# EAGLE design Bus_Control (EAGLE 9.6.2)
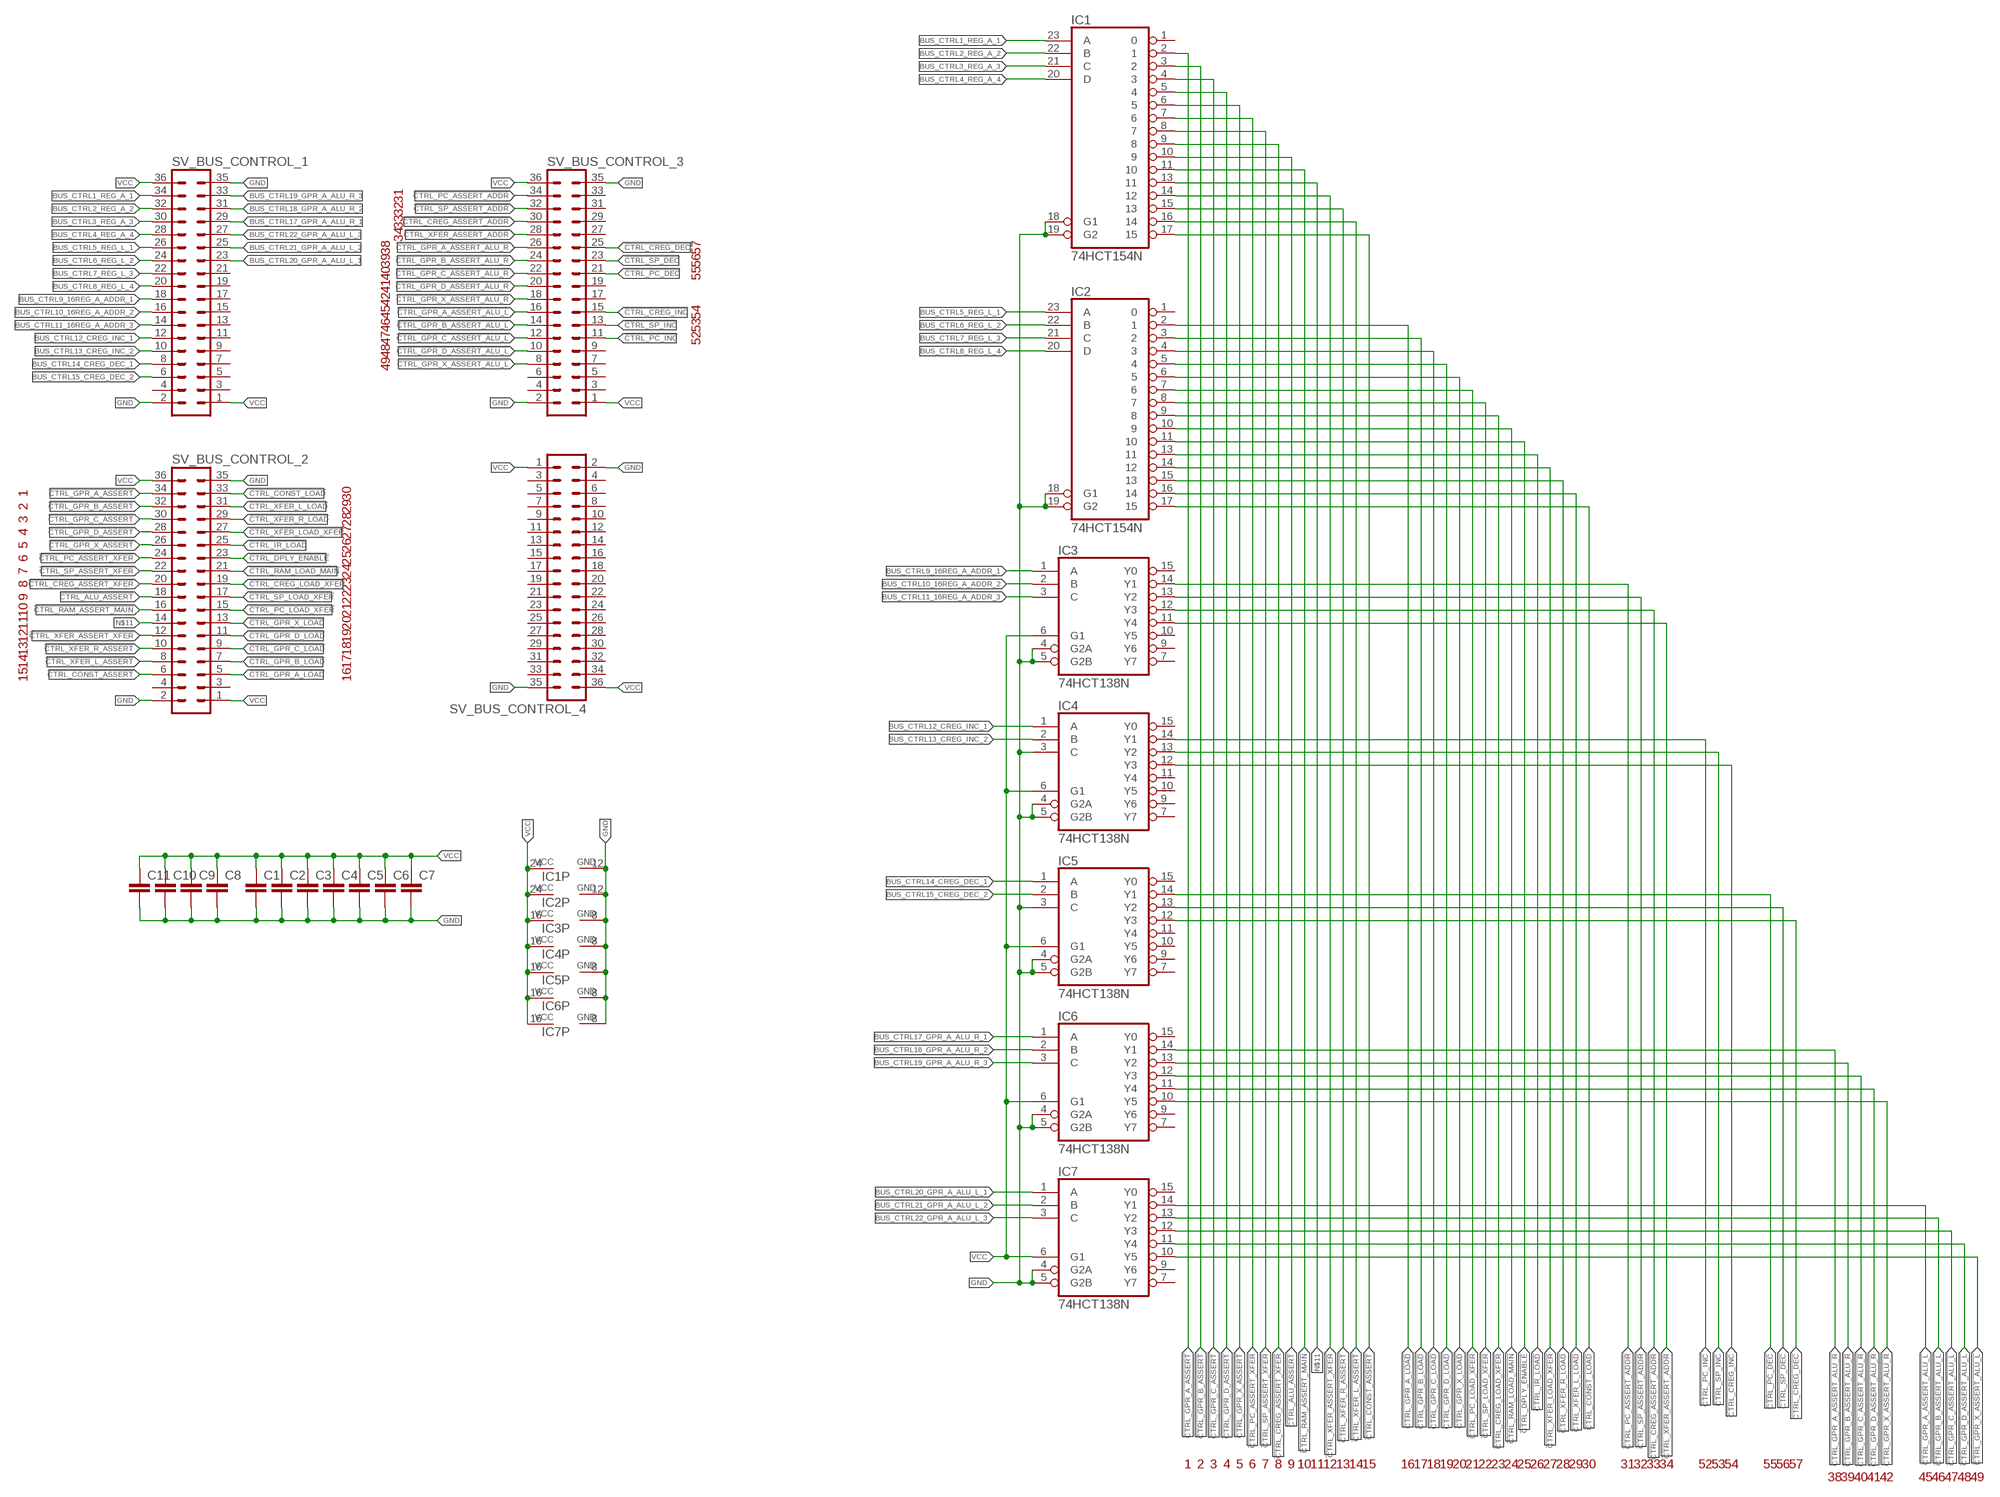
[diagram p0: schematic, sheet 1]

## Parts
C1  C-EUC0805  [C0805]
C2  C-EUC0805  [C0805]
C3  C-EUC0805  [C0805]
C4  C-EUC0805  [C0805]
C5  C-EUC0805  [C0805]
C6  C-EUC0805  [C0805]
C7  C-EUC0805  [C0805]
C8  C-EUC0805  [C0805]
C9  C-EUC0805  [C0805]
C10  C-EUC0805  [C0805]
C11  C-EUC0805  [C0805]
IC1  74HCT154N  74HC154N  [DIL24-6]
IC2  74HCT154N  74HC154N  [DIL24-6]
IC3  74HCT138N  [DIL16]
IC4  74HCT138N  [DIL16]
IC5  74HCT138N  [DIL16]
IC6  74HCT138N  [DIL16]
IC7  74HCT138N  [DIL16]
SV_BUS_CONTROL_1  MA18-2  [MA18-2]
SV_BUS_CONTROL_2  MA18-2  [MA18-2]
SV_BUS_CONTROL_3  MA18-2  [MA18-2]
SV_BUS_CONTROL_4  MA18-2  [MA18-2]

## Nets
!CTRL_ALU_ASSERT: IC1.10 SV_BUS_CONTROL_2.18
!CTRL_CONST_ASSERT: IC1.17 SV_BUS_CONTROL_2.6
!CTRL_CONST_LOAD: IC2.17 SV_BUS_CONTROL_2.33
!CTRL_CREG_ASSERT_ADDR: IC3.12(Y3) SV_BUS_CONTROL_3.30
!CTRL_CREG_ASSERT_XFER: IC1.9 SV_BUS_CONTROL_2.20
!CTRL_CREG_DEC: IC5.12(Y3) SV_BUS_CONTROL_3.25
!CTRL_CREG_INC: IC4.12(Y3) SV_BUS_CONTROL_3.15
!CTRL_CREG_LOAD_XFER: IC2.9 SV_BUS_CONTROL_2.19
!CTRL_DPLY_ENABLE: IC2.11 SV_BUS_CONTROL_2.23
!CTRL_GPR_A_ASSERT: IC1.2 SV_BUS_CONTROL_2.34
!CTRL_GPR_A_ASSERT_ALU_L: IC7.14(Y1) SV_BUS_CONTROL_3.16
!CTRL_GPR_A_ASSERT_ALU_R: IC6.14(Y1) SV_BUS_CONTROL_3.26
!CTRL_GPR_A_LOAD: IC2.2 SV_BUS_CONTROL_2.5
!CTRL_GPR_B_ASSERT: IC1.3 SV_BUS_CONTROL_2.32
!CTRL_GPR_B_ASSERT_ALU_L: IC7.13(Y2) SV_BUS_CONTROL_3.14
!CTRL_GPR_B_ASSERT_ALU_R: IC6.13(Y2) SV_BUS_CONTROL_3.24
!CTRL_GPR_B_LOAD: IC2.3 SV_BUS_CONTROL_2.7
!CTRL_GPR_C_ASSERT: IC1.4 SV_BUS_CONTROL_2.30
!CTRL_GPR_C_ASSERT_ALU_L: IC7.12(Y3) SV_BUS_CONTROL_3.12
!CTRL_GPR_C_ASSERT_ALU_R: IC6.12(Y3) SV_BUS_CONTROL_3.22
!CTRL_GPR_C_LOAD: IC2.4 SV_BUS_CONTROL_2.9
!CTRL_GPR_D_ASSERT: IC1.5 SV_BUS_CONTROL_2.28
!CTRL_GPR_D_ASSERT_ALU_L: IC7.11(Y4) SV_BUS_CONTROL_3.10
!CTRL_GPR_D_ASSERT_ALU_R: IC6.11(Y4) SV_BUS_CONTROL_3.20
!CTRL_GPR_D_LOAD: IC2.5 SV_BUS_CONTROL_2.11
!CTRL_GPR_X_ASSERT: IC1.6 SV_BUS_CONTROL_2.26
!CTRL_GPR_X_ASSERT_ALU_L: IC7.10(Y5) SV_BUS_CONTROL_3.8
!CTRL_GPR_X_ASSERT_ALU_R: IC6.10(Y5) SV_BUS_CONTROL_3.18
!CTRL_GPR_X_LOAD: IC2.6 SV_BUS_CONTROL_2.13
!CTRL_IR_LOAD: IC2.13 SV_BUS_CONTROL_2.25
!CTRL_PC_ASSERT_ADDR: IC3.14(Y1) SV_BUS_CONTROL_3.34
!CTRL_PC_ASSERT_XFER: IC1.7 SV_BUS_CONTROL_2.24
!CTRL_PC_DEC: IC5.14(Y1) SV_BUS_CONTROL_3.21
!CTRL_PC_INC: IC4.14(Y1) SV_BUS_CONTROL_3.11
!CTRL_PC_LOAD_XFER: IC2.7 SV_BUS_CONTROL_2.15
!CTRL_RAM_ASSERT_MAIN: IC1.11 SV_BUS_CONTROL_2.16
!CTRL_RAM_LOAD_MAIN: IC2.10 SV_BUS_CONTROL_2.21
!CTRL_SP_ASSERT_ADDR: IC3.13(Y2) SV_BUS_CONTROL_3.32
!CTRL_SP_ASSERT_XFER: IC1.8 SV_BUS_CONTROL_2.22
!CTRL_SP_DEC: IC5.13(Y2) SV_BUS_CONTROL_3.23
!CTRL_SP_INC: IC4.13(Y2) SV_BUS_CONTROL_3.13
!CTRL_SP_LOAD_XFER: IC2.8 SV_BUS_CONTROL_2.17
!CTRL_XFER_ASSERT_ADDR: IC3.11(Y4) SV_BUS_CONTROL_3.28
!CTRL_XFER_ASSERT_XFER: IC1.14 SV_BUS_CONTROL_2.12
!CTRL_XFER_L_ASSERT: IC1.16 SV_BUS_CONTROL_2.8
!CTRL_XFER_L_LOAD: IC2.16 SV_BUS_CONTROL_2.31
!CTRL_XFER_LOAD_XFER: IC2.14 SV_BUS_CONTROL_2.27
!CTRL_XFER_R_ASSERT: IC1.15 SV_BUS_CONTROL_2.10
!CTRL_XFER_R_LOAD: IC2.15 SV_BUS_CONTROL_2.29
BUS_CTRL1_REG_A_1: IC1.23(A) SV_BUS_CONTROL_1.34
BUS_CTRL2_REG_A_2: IC1.22(B) SV_BUS_CONTROL_1.32
BUS_CTRL3_REG_A_3: IC1.21(C) SV_BUS_CONTROL_1.30
BUS_CTRL4_REG_A_4: IC1.20(D) SV_BUS_CONTROL_1.28
BUS_CTRL5_REG_L_1: IC2.23(A) SV_BUS_CONTROL_1.26
BUS_CTRL6_REG_L_2: IC2.22(B) SV_BUS_CONTROL_1.24
BUS_CTRL7_REG_L_3: IC2.21(C) SV_BUS_CONTROL_1.22
BUS_CTRL8_REG_L_4: IC2.20(D) SV_BUS_CONTROL_1.20
BUS_CTRL9_16REG_A_ADDR_1: IC3.1(A) SV_BUS_CONTROL_1.18
BUS_CTRL10_16REG_A_ADDR_2: IC3.2(B) SV_BUS_CONTROL_1.16
BUS_CTRL11_16REG_A_ADDR_3: IC3.3(C) SV_BUS_CONTROL_1.14
BUS_CTRL12_CREG_INC_1: IC4.1(A) SV_BUS_CONTROL_1.12
BUS_CTRL13_CREG_INC_2: IC4.2(B) SV_BUS_CONTROL_1.10
BUS_CTRL14_CREG_DEC_1: IC5.1(A) SV_BUS_CONTROL_1.8
BUS_CTRL15_CREG_DEC_2: IC5.2(B) SV_BUS_CONTROL_1.6
BUS_CTRL17_GPR_A_ALU_R_1: IC6.1(A) SV_BUS_CONTROL_1.29
BUS_CTRL18_GPR_A_ALU_R_2: IC6.2(B) SV_BUS_CONTROL_1.31
BUS_CTRL19_GPR_A_ALU_R_3: IC6.3(C) SV_BUS_CONTROL_1.33
BUS_CTRL20_GPR_A_ALU_L_1: IC7.1(A) SV_BUS_CONTROL_1.23
BUS_CTRL21_GPR_A_ALU_L_2: IC7.2(B) SV_BUS_CONTROL_1.25
BUS_CTRL22_GPR_A_ALU_L_3: IC7.3(C) SV_BUS_CONTROL_1.27
GND: C1.2 C2.2 C3.2 C4.2 C5.2 C6.2 C7.2 C8.2 C9.2 C10.2 C11.2 IC1.12(GND) IC1.18(G1) IC1.19(G2) IC2.12(GND) IC2.18(G1) IC2.19(G2) IC3.4(G2A) IC3.5(G2B) IC3.8(GND) IC4.3(C) IC4.4(G2A) IC4.5(G2B) IC4.8(GND) IC5.3(C) IC5.4(G2A) IC5.5(G2B) IC5.8(GND) IC6.4(G2A) IC6.5(G2B) IC6.8(GND) IC7.4(G2A) IC7.5(G2B) IC7.8(GND) SV_BUS_CONTROL_1.2 SV_BUS_CONTROL_1.35 SV_BUS_CONTROL_2.2 SV_BUS_CONTROL_2.35 SV_BUS_CONTROL_3.2 SV_BUS_CONTROL_3.35 SV_BUS_CONTROL_4.2 SV_BUS_CONTROL_4.35
N$11: IC1.13 SV_BUS_CONTROL_2.14
VCC: C1.1 C2.1 C3.1 C4.1 C5.1 C6.1 C7.1 C8.1 C9.1 C10.1 C11.1 IC1.24(VCC) IC2.24(VCC) IC3.6(G1) IC3.16(VCC) IC4.6(G1) IC4.16(VCC) IC5.6(G1) IC5.16(VCC) IC6.6(G1) IC6.16(VCC) IC7.6(G1) IC7.16(VCC) SV_BUS_CONTROL_1.1 SV_BUS_CONTROL_1.36 SV_BUS_CONTROL_2.1 SV_BUS_CONTROL_2.36 SV_BUS_CONTROL_3.1 SV_BUS_CONTROL_3.36 SV_BUS_CONTROL_4.1 SV_BUS_CONTROL_4.36
Unconnected: IC1.1 IC2.1 IC3.7(Y7) IC3.9(Y6) IC3.10(Y5) IC3.15(Y0) IC4.7(Y7) IC4.9(Y6) IC4.10(Y5) IC4.11(Y4) IC4.15(Y0) IC5.7(Y7) IC5.9(Y6) IC5.10(Y5) IC5.11(Y4) IC5.15(Y0) IC6.7(Y7) IC6.9(Y6) IC6.15(Y0) IC7.7(Y7) IC7.9(Y6) IC7.15(Y0) SV_BUS_CONTROL_1.3 SV_BUS_CONTROL_1.4 SV_BUS_CONTROL_1.5 SV_BUS_CONTROL_1.7 SV_BUS_CONTROL_1.9 SV_BUS_CONTROL_1.11 SV_BUS_CONTROL_1.13 SV_BUS_CONTROL_1.15 SV_BUS_CONTROL_1.17 SV_BUS_CONTROL_1.19 SV_BUS_CONTROL_1.21 SV_BUS_CONTROL_2.3 SV_BUS_CONTROL_2.4 SV_BUS_CONTROL_3.3 SV_BUS_CONTROL_3.4 SV_BUS_CONTROL_3.5 SV_BUS_CONTROL_3.6 SV_BUS_CONTROL_3.7 SV_BUS_CONTROL_3.9 SV_BUS_CONTROL_3.17 SV_BUS_CONTROL_3.19 SV_BUS_CONTROL_3.27 SV_BUS_CONTROL_3.29 SV_BUS_CONTROL_3.31 SV_BUS_CONTROL_3.33 SV_BUS_CONTROL_4.3 SV_BUS_CONTROL_4.4 SV_BUS_CONTROL_4.5 SV_BUS_CONTROL_4.6 SV_BUS_CONTROL_4.7 SV_BUS_CONTROL_4.8 SV_BUS_CONTROL_4.9 SV_BUS_CONTROL_4.10 SV_BUS_CONTROL_4.11 SV_BUS_CONTROL_4.12 SV_BUS_CONTROL_4.13 SV_BUS_CONTROL_4.14 SV_BUS_CONTROL_4.15 SV_BUS_CONTROL_4.16 SV_BUS_CONTROL_4.17 SV_BUS_CONTROL_4.18 SV_BUS_CONTROL_4.19 SV_BUS_CONTROL_4.20 SV_BUS_CONTROL_4.21 SV_BUS_CONTROL_4.22 SV_BUS_CONTROL_4.23 SV_BUS_CONTROL_4.24 SV_BUS_CONTROL_4.25 SV_BUS_CONTROL_4.26 SV_BUS_CONTROL_4.27 SV_BUS_CONTROL_4.28 SV_BUS_CONTROL_4.29 SV_BUS_CONTROL_4.30 SV_BUS_CONTROL_4.31 SV_BUS_CONTROL_4.32 SV_BUS_CONTROL_4.33 SV_BUS_CONTROL_4.34

## Notes on the sheet
- 31
- 32
- 33
- 34
- 38 | 57
- 39 | 56
- 40 | 55
- 41
- 42
- 45 | 54
- 46 | 53
- 47 | 52
- 48
- 49
- 1 | 30
- 2 | 29
- 3 | 28
- 4 | 27
- 5 | 26
- 6 | 25
- 7 | 24
- 8 | 23
- 9 | 22
- 10 | 21
- 11 | 20
- 12 | 19
- 13 | 18
- 14 | 17
- 15 | 16
- 1 | 2 | 3 | 4 | 5 | 6 | 7 | 8 | 9 | 10 | 11 | 12 | 13 | 14 | 15 | 16 | 17 | 18 | 19 | 20 | 21 | 22 | 23 | 24 | 25 | 26 | 27 | 28 | 29 | 30 | 31 | 32 | 33 | 34 | 52 | 53 | 54 | 55 | 56 | 57
- 38 | 39 | 40 | 41 | 42 | 45 | 46 | 47 | 48 | 49

## Library data of the parts
C1-C11 = rcl:C-EU: CAPACITOR, European symbol; SPICEPREFIX: C
IC1 IC2 = 74xx-eu:74*154: 4-line to 16-line data SELECTOR/MULTIPLEXER
IC3-IC7 = 74xx-eu:74*138: 3-line to 8-line DECODER/DEMULTIPLEXER
SV_BUS_CONTROL_1-SV_BUS_CONTROL_4 = con-lstb:MA18-2: PIN HEADER; OC_FARNELL: unknown; OC_NEWARK: unknown

## Board
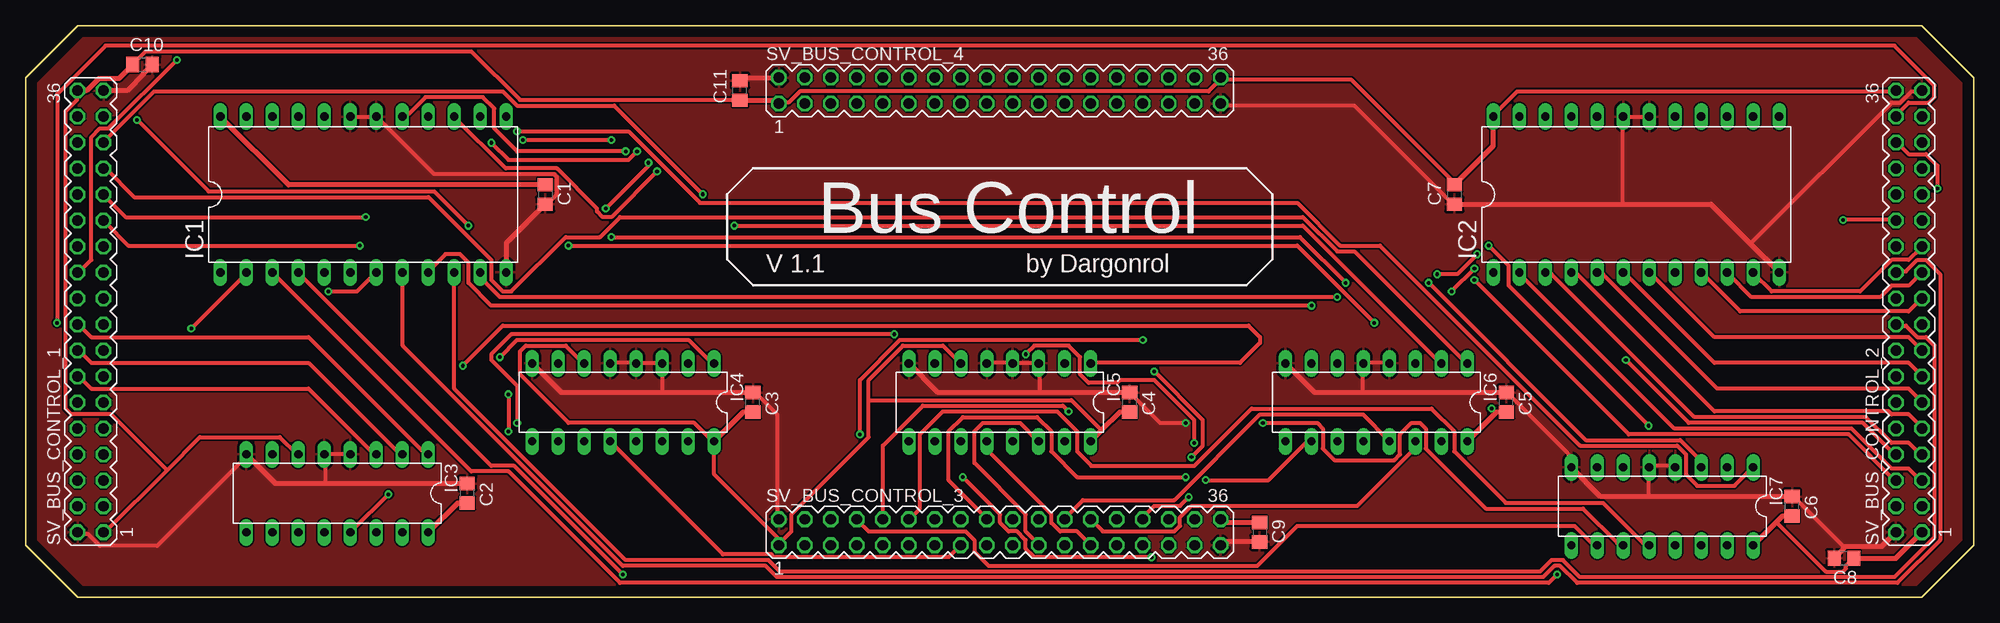
[diagram p1: board, top side]
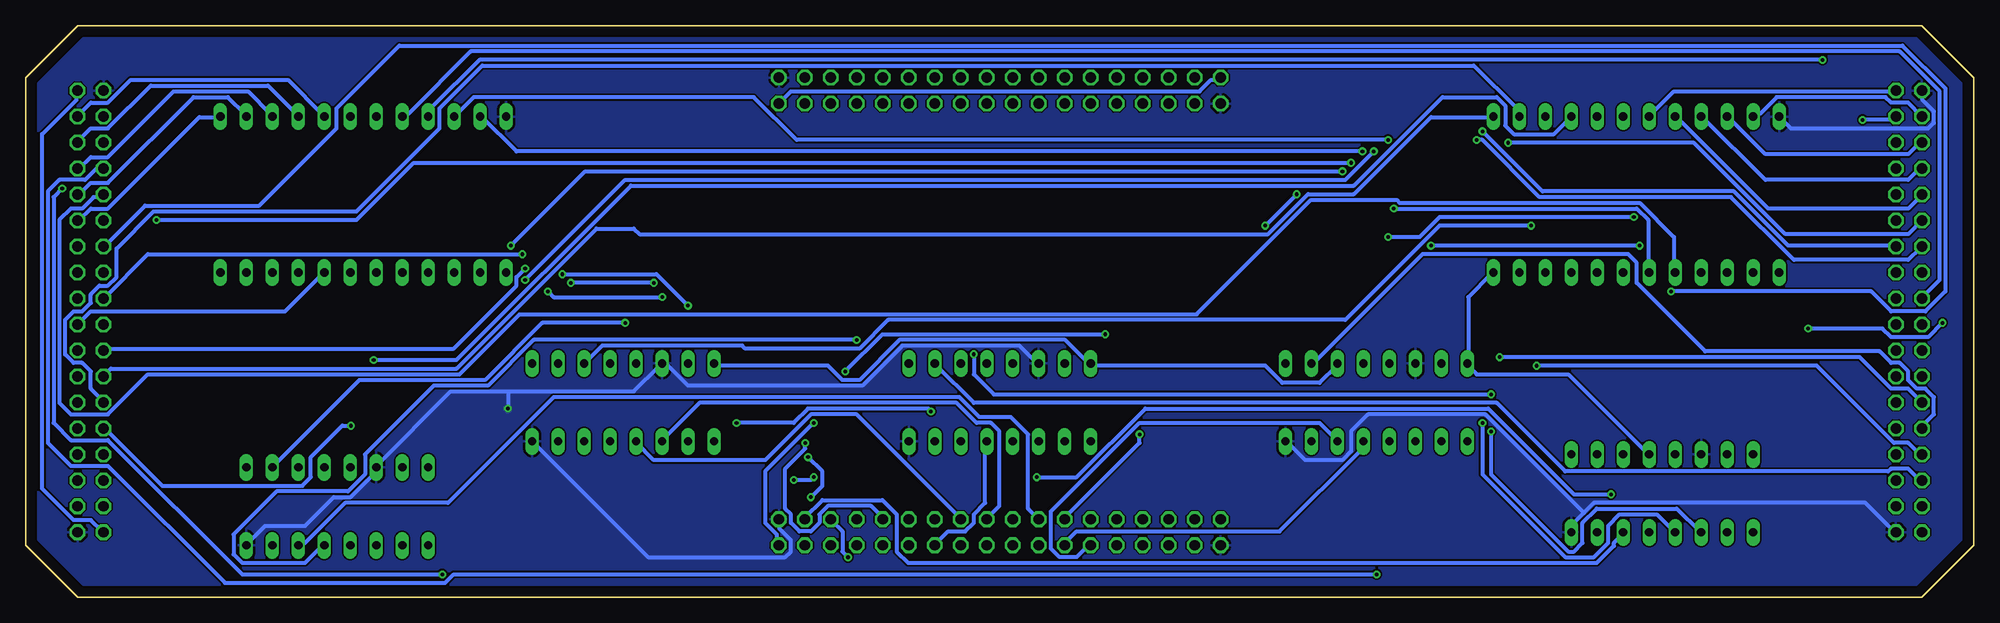
[diagram p2: board, bottom side, seen from below]

Size 190.5 x 55.88 mm. Coordinates in mm from the lower left corner, seen from the top.
Outline: 0,5.08 5.08,0 185.42,0 190.5,5.08 190.5,50.8 185.42,55.88 5.08,55.88 0,50.8 0,5.08
Copper layers (1*16): Top 0.035mm / dielectric 1.5mm / Bottom 0.035mm
Design rules "default *": minimum track width 16mil, minimum drill 0.35mm, track to track 6mil, track to pad 6mil, pad to pad 6mil, via to via 6mil, smd to smd 6mil, copper to edge 40mil, drill to drill 6mil, minimum pad ring 10mil, minimum via ring 8mil, stop-mask expansion 4mil, vias tented up to drill 0mil, thermal gap 10mil

### Footprints (pad centres in the part's own frame; a part is rotated, then mirrored left to right if it is on the bottom)
C0805 = smd 1.3 x 1.5: 1 -0.95,0; 2 0.95,0
DIL24-6 = drill 0.813 long: 1 -13.97,-7.62; 2 -11.43,-7.62; 3 -8.89,-7.62; 4 -6.35,-7.62; 5 -3.81,-7.62; 6 -1.27,-7.62; 7 1.27,-7.62; 8 3.81,-7.62; 9 6.35,-7.62; 10 8.89,-7.62; 11 11.43,-7.62; 12 13.97,-7.62; 13 13.97,7.62; 14 11.43,7.62; 15 8.89,7.62; 16 6.35,7.62; 17 3.81,7.62; 18 1.27,7.62; 19 -1.27,7.62; 20 -3.81,7.62; 21 -6.35,7.62; 22 -8.89,7.62; 23 -11.43,7.62; 24 -13.97,7.62
DIL16 = drill 0.813 long: 1 -8.89,-3.81; 2 -6.35,-3.81; 3 -3.81,-3.81; 4 -1.27,-3.81; 5 1.27,-3.81; 6 3.81,-3.81; 7 6.35,-3.81; 8 8.89,-3.81; 9 8.89,3.81; 10 6.35,3.81; 11 3.81,3.81; 12 1.27,3.81; 13 -1.27,3.81; 14 -3.81,3.81; 15 -6.35,3.81; 16 -8.89,3.81
MA18-2 = drill 1.016 octagon: 1 -21.59,-1.27; 2 -21.59,1.27; 3 -19.05,-1.27; 4 -19.05,1.27; 5 -16.51,-1.27; 6 -16.51,1.27; 7 -13.97,-1.27; 8 -13.97,1.27; 9 -11.43,-1.27; 10 -11.43,1.27; 11 -8.89,-1.27; 12 -8.89,1.27; 13 -6.35,-1.27; 14 -6.35,1.27; 15 -3.81,-1.27; 16 -3.81,1.27; 17 -1.27,-1.27; 18 -1.27,1.27; 19 1.27,-1.27; 20 1.27,1.27; 21 3.81,-1.27; 22 3.81,1.27; 23 6.35,-1.27; 24 6.35,1.27; 25 8.89,-1.27; 26 8.89,1.27; 27 11.43,-1.27; 28 11.43,1.27; 29 13.97,-1.27; 30 13.97,1.27; 31 16.51,-1.27; 32 16.51,1.27; 33 19.05,-1.27; 34 19.05,1.27; 35 21.59,-1.27; 36 21.59,1.27

### Placement (x,y rotation side)
C1  50.8,39.37 270 top
C2  43.18,10.16 90 top
C3  71.12,19.05 90 top
C4  107.95,19.05 90 top
C5  144.78,19.05 90 top
C6  172.72,8.89 90 top
C7  139.7,39.37 270 top
C8  177.8,3.81 180 top
C9  120.65,6.35 270 top
C10  11.43,52.07 0 top
C11  69.85,49.53 90 top
IC1  33.02,39.37 0 top
IC2  157.48,39.37 0 top
IC3  30.48,10.16 180 top
IC4  58.42,19.05 180 top
IC5  95.25,19.05 180 top
IC6  132.08,19.05 180 top
IC7  160.02,8.89 180 top
SV_BUS_CONTROL_1  6.35,27.94 90 top
SV_BUS_CONTROL_2  184.15,27.94 90 top
SV_BUS_CONTROL_3  95.25,6.35 0 top
SV_BUS_CONTROL_4  95.25,49.53 0 top

### Tracks (layer width: path | path; a pad name or v marks a point on that pad's centre or on a via)
!CTRL_ALU_ASSERT
  Top 0.406: IC1.10 41.91,20.4 58.67,3.63 72.64,3.63 73.76,2.52 148.08,2.52 149.2,3.63 150.32,3.63 151.99,1.96 182.73,1.96 186.64,5.87 186.64,24.59 185.8,25.43 184.96,25.43 183.84,26.54 183.01,26.54 SV_BUS_CONTROL_2.18
!CTRL_CONST_ASSERT  (via drill 0.35)
  Top 0.406: v58.67,43.59 48.06,43.59 45.82,45.82 45.82,47.78 44.7,48.9 39.12,48.9 37.44,47.22 36.88,47.22 IC1.17 | v141.66,31.01 156.74,15.93 178.26,15.93 182.73,11.46 SV_BUS_CONTROL_2.6
  Bottom 0.406: v58.67,43.59 61.47,40.79 131.88,40.79 v141.66,31.01
!CTRL_CONST_LOAD
  Bottom 0.406: IC2.17 161.49,47.22 164.85,50.57 180.21,50.57 182.45,48.34 184.12,48.34 185.24,47.22 SV_BUS_CONTROL_2.33
!CTRL_CREG_ASSERT_ADDR  (via drill 0.35)
  Top 0.406: v48.06,17.04 48.06,20.68 45.54,23.19 45.54,23.75 47.5,25.7 v84.94,25.7 | v110.36,22.07 115.11,17.32 115.11,14.81 v114,13.69 | v113.72,9.78 112.88,8.94 110.36,8.94 109.25,7.82 SV_BUS_CONTROL_3.30
  Bottom 0.406: v48.06,17.04 48.06,12.01 39.95,3.91 37.16,3.91 35.76,5.31 35.76,6.99 34.65,8.1 31.01,8.1 29.34,6.43 IC3.12 | v84.94,25.7 106.73,25.7 v110.36,22.07 | v114,13.69 112.6,12.29 112.6,10.9 v113.72,9.78
!CTRL_CREG_ASSERT_XFER  (via drill 0.35)
  Top 0.406: v125.73,28.5 45.54,28.5 43.31,30.73 43.31,32.69 42.47,33.53 41.07,33.53 39.4,31.85 IC1.9 | v138.02,31.57 139.98,31.57 v141.94,33.53
  Bottom 0.406: v125.73,28.5 128.8,31.57 v138.02,31.57 | v141.94,33.53 178.54,33.53 182.73,29.34 SV_BUS_CONTROL_2.20
!CTRL_CREG_DEC
  Top 0.406: IC5.12 94.16,15.09 94.16,14.25 100.31,8.1 100.31,7.26 101.14,6.43 102.82,6.43 103.94,5.31 SV_BUS_CONTROL_3.25
!CTRL_CREG_INC
  Top 0.406: IC4.12 57.28,15.09 68.17,4.19 72.92,4.19 73.2,3.91 90.25,3.91 91.36,5.03 SV_BUS_CONTROL_3.15
!CTRL_CREG_LOAD_XFER
  Top 0.406: IC2.9 167.64,27.94 184.12,27.94 185.24,29.06 SV_BUS_CONTROL_2.19
!CTRL_DPLY_ENABLE
  Top 0.406: IC2.11 169.04,31.57 170.71,29.9 179.38,29.9 182.45,32.97 184.12,32.97 185.24,34.09 SV_BUS_CONTROL_2.23
!CTRL_GPR_A_ASSERT  (via drill 0.35)
  Top 0.406: v16.2,26.26 21.51,31.57 IC1.2 | v3.07,26.82 3.07,49.17 7.82,53.92 182.73,53.92 186.64,50.01 186.64,48.9 186.08,48.34 184.12,48.34 183.01,47.22 SV_BUS_CONTROL_2.34
  Bottom 0.406: v16.2,26.26 8.94,26.26 8.1,25.43 4.47,25.43 v3.07,26.82
!CTRL_GPR_A_ASSERT_ALU_L
  Bottom 0.406: SV_BUS_CONTROL_3.16 92.48,8.66 92.48,15.93 94.16,17.6 97.23,17.6 99.19,19.56 138.86,19.56 149.2,9.22 159.26,9.22 163.17,5.31 163.73,5.31 IC7.14
!CTRL_GPR_A_ASSERT_ALU_R
  Top 0.406: SV_BUS_CONTROL_3.26 105.33,6.43 112.32,6.43 112.88,6.99 112.88,7.82 114,8.94 130.2,8.94 135.79,14.53 135.79,15.09 IC6.14
!CTRL_GPR_A_LOAD
  Top 0.406: IC2.2 146.13,31.57 161.21,16.48 178.54,16.48 182.45,12.57 184.12,12.57 185.24,11.46 SV_BUS_CONTROL_2.5
!CTRL_GPR_B_ASSERT  (via drill 0.35)
  Top 0.406: IC1.3 43.59,12.29 47.22,12.29 58.12,1.4 148.92,1.4 v149.76,2.23 | v186.92,39.95 186.92,42.19 185.8,43.31 184.12,43.31 183.01,44.42 SV_BUS_CONTROL_2.32
  Bottom 0.406: v149.76,2.23 169.32,2.23 182.45,15.37 186.08,15.37 187.76,17.04 187.76,39.12 v186.92,39.95
!CTRL_GPR_B_ASSERT_ALU_L  (via drill 0.35)
  Top 0.406: v109.25,25.15 85.5,25.15 81.58,21.23 v81.58,15.93
  Bottom 0.406: v109.25,25.15 140.82,25.15 145.29,20.68 150.6,20.68 157.3,13.97 157.3,12.01 158.98,10.34 165.96,10.34 170.16,6.15 170.16,4.19 169.32,3.35 163.17,3.35 161.49,5.03 IC7.13 | v81.58,15.93 81.58,15.09 88.85,7.82 SV_BUS_CONTROL_3.14
!CTRL_GPR_B_ASSERT_ALU_R
  Top 0.406: IC6.13 133.27,15.37 130.76,17.88 120.7,17.88 112.32,9.5 103.38,9.5 101.7,7.82 SV_BUS_CONTROL_3.24
!CTRL_GPR_B_LOAD
  Top 0.406: IC2.3 148.64,31.57 149.2,31.57 163.17,17.6 179.93,17.6 182.45,15.09 184.12,15.09 185.24,13.97 SV_BUS_CONTROL_2.7
!CTRL_GPR_C_ASSERT  (via drill 0.35)
  Top 0.406: v58.4,2.23 47.78,12.85 45.54,12.85 26.82,31.57 IC1.4
  Bottom 0.406: v58.4,2.23 148.64,2.23 149.48,1.4 170.99,1.4 182.45,12.85 186.08,12.85 188.32,15.09 188.32,39.67 187.2,40.79 184.68,40.79 183.57,41.91 SV_BUS_CONTROL_2.30
!CTRL_GPR_C_ASSERT_ALU_L
  Top 0.406: IC7.12 158.7,5.31 158.14,5.31 154.23,9.22 144.73,9.22 139.7,14.25 139.7,16.2 137.47,18.44 119.86,18.44 114.28,12.85 104.22,12.85 102.82,14.25 102.82,16.2 100.86,18.16 89.69,18.16 87.45,15.93 87.45,8.66 86.61,7.82 SV_BUS_CONTROL_3.12
!CTRL_GPR_C_ASSERT_ALU_R
  Bottom 0.406: IC6.12 130.76,15.09 129.08,13.41 118.19,13.41 113.72,17.88 109.25,17.88 99.19,7.82 SV_BUS_CONTROL_3.22
!CTRL_GPR_C_LOAD
  Top 0.406: IC2.4 151.16,31.57 151.71,31.57 165.12,18.16 182.17,18.16 182.45,17.88 184.12,17.88 185.24,16.76 SV_BUS_CONTROL_2.9
!CTRL_GPR_D_ASSERT
  Bottom 0.406: IC1.5 29.34,31.85 29.34,35.2 32.69,38.56 56.16,38.56 56.44,38.84 64.82,38.84 76,27.66 142.22,27.66 148.08,21.79 178.54,21.79 182.45,17.88 186.08,17.88 187.2,19 187.2,36.88 186.08,38 184.96,38 183.84,39.12 183.01,39.12 SV_BUS_CONTROL_2.28
!CTRL_GPR_D_ASSERT_ALU_L  (via drill 0.35)
  Top 0.406: v120.98,17.04 126.29,17.04 126.85,16.48 126.85,14.53 127.97,13.41 133.83,13.41 134.39,13.97 134.39,15.93 135.51,17.04 136.35,17.04 136.91,16.48 136.91,14.53 142.77,8.66 152.27,8.66 155.63,5.31 156.19,5.31 IC7.11 | v101.98,18.16 101.42,18.72 87.73,18.72 83.82,14.81 SV_BUS_CONTROL_3.10
  Bottom 0.406: v120.98,17.04 115.39,17.04 114,18.44 102.26,18.44 v101.98,18.16
!CTRL_GPR_D_ASSERT_ALU_R
  Bottom 0.406: IC6.11 128.25,15.37 124.61,19 99.47,19 97.51,17.04 96.11,17.04 95.28,16.2 95.28,8.94 96.39,7.82 SV_BUS_CONTROL_3.20
!CTRL_GPR_D_LOAD
  Top 0.406: IC2.5 153.67,31.57 154.23,31.57 165.41,20.4 184.12,20.4 185.24,19.28 SV_BUS_CONTROL_2.11
!CTRL_GPR_X_ASSERT  (via drill 0.35)
  Top 0.406: v56.72,38 60.91,42.19 v60.91,42.47 | v177.7,36.88 182.73,36.88 SV_BUS_CONTROL_2.26
  Bottom 0.406: v56.72,38 32.97,38 31.85,36.88 31.85,31.85 IC1.6 | v60.91,42.47 152.55,42.47 158.14,36.88 v177.7,36.88
!CTRL_GPR_X_ASSERT_ALU_L
  Top 0.406: IC7.10 153.67,5.31 153.11,5.31 151.44,6.99 124.33,6.99 120.42,3.07 94.16,3.07 92.76,4.47 92.76,5.59 91.92,6.43 82.42,6.43 81.31,7.54 SV_BUS_CONTROL_3.8
!CTRL_GPR_X_ASSERT_ALU_R  (via drill 0.35)
  Top 0.406: v115.39,11.46 121.54,11.46 125.17,15.09 125.73,15.09 IC6.10 | v113.44,11.73 102.82,11.73 100.31,14.25 100.31,16.2 98.91,17.6 91.64,17.6 90.25,16.2 90.25,11.46 93.88,7.82 SV_BUS_CONTROL_3.18
  Bottom 0.406: v115.39,11.46 113.72,11.46 v113.44,11.73
!CTRL_GPR_X_LOAD
  Top 0.406: IC2.6 156.46,31.57 165.12,22.91 184.12,22.91 185.24,21.79 SV_BUS_CONTROL_2.13
!CTRL_IR_LOAD
  Bottom 0.406: IC2.13 171.55,46.94 173.51,46.94 182.45,38 184.12,38 185.24,36.88 SV_BUS_CONTROL_2.25
!CTRL_PC_ASSERT_ADDR
  Bottom 0.406: IC3.14 34.37,6.15 35.2,5.31 35.2,5.03 36.88,3.35 104.22,3.35 105.33,4.47 105.33,8.1 106.73,9.5 112.6,9.5 114.28,7.82 SV_BUS_CONTROL_3.34
!CTRL_PC_ASSERT_XFER  (via drill 0.35)
  Top 0.406: v29.62,29.9 32.41,29.9 34.09,31.57 IC1.7
  Bottom 0.406: v29.62,29.9 10.06,29.9 8.1,27.94 4.75,27.94 2.79,29.9 2.79,49.73 6.99,53.92 153.95,53.92 160.1,47.78 160.1,45.82 167.64,38.28 178.82,38.28 182.73,34.37 SV_BUS_CONTROL_2.24
!CTRL_PC_DEC
  Top 0.406: IC5.14 98.91,15.37 97.23,17.04 93.6,17.04 92.76,16.2 92.76,13.13 97.79,8.1 97.79,6.43 98.91,5.31 SV_BUS_CONTROL_3.21
!CTRL_PC_INC
  Bottom 0.406: IC4.14 62.31,15.37 63.98,17.04 81.58,17.04 90.25,8.38 90.25,4.75 89.41,3.91 87.73,3.91 86.61,5.03 SV_BUS_CONTROL_3.11
!CTRL_PC_LOAD_XFER
  Top 0.406: SV_BUS_CONTROL_2.15 184.12,25.43 165.12,25.43 158.98,31.57 IC2.7
!CTRL_RAM_ASSERT_MAIN  (via drill 0.35)
  Top 0.406: v128.25,29.34 46.38,29.34 44.7,31.01 44.7,31.57 IC1.11 | v141.66,32.13 v139.42,29.9
  Bottom 0.406: v128.25,29.34 138.86,29.34 v139.42,29.9 | v141.66,32.13 142.49,31.29 142.49,30.45 148.64,24.31 182.73,24.31 SV_BUS_CONTROL_2.16
!CTRL_RAM_LOAD_MAIN
  Top 0.406: SV_BUS_CONTROL_2.21 184.12,30.45 182.45,30.45 181.33,29.34 168.76,29.34 166.52,31.57 IC2.10
!CTRL_SP_ASSERT_ADDR  (via drill 0.35)
  Top 0.406: v35.48,10.06 31.85,6.43 IC3.13 | v91.64,11.73 95.28,8.1 95.28,7.26 96.11,6.43 96.95,6.43 97.79,5.59 97.79,4.75 98.63,3.91 v110.08,3.91
  Bottom 0.406: v35.48,10.06 39.12,10.06 47.5,18.44 81.03,18.44 87.73,11.73 v91.64,11.73 | v110.08,3.91 110.64,4.47 110.64,6.43 111.76,7.54 SV_BUS_CONTROL_3.32
!CTRL_SP_ASSERT_XFER
  Top 0.406: IC1.8 36.88,31.57 36.88,24.59 58.4,3.07 72.36,3.07 73.48,1.96 148.36,1.96 149.48,3.07 150.04,3.07 151.71,1.4 183.01,1.4 187.2,5.59 187.2,31.57 185.8,32.97 184.96,32.97 183.84,31.85 183.01,31.85 SV_BUS_CONTROL_2.22
!CTRL_SP_DEC
  Bottom 0.406: IC5.13 96.67,15.09 96.67,9.22 97.79,8.1 97.79,7.26 98.63,6.43 100.31,6.43 101.42,5.31 SV_BUS_CONTROL_3.23
!CTRL_SP_INC
  Bottom 0.406: IC4.13 59.79,15.09 59.79,14.53 67.89,6.43 87.73,6.43 88.85,5.31 SV_BUS_CONTROL_3.13
!CTRL_SP_LOAD_XFER
  Bottom 0.406: IC2.8 161.49,31.57 165.12,27.94 184.12,27.94 185.24,26.82 SV_BUS_CONTROL_2.17
!CTRL_XFER_ASSERT_ADDR  (via drill 0.35)
  Top 0.406: v47.22,19.84 v47.22,16.2 | v97.79,23.75 98.63,24.59 101.98,24.59 103.1,23.47 103.1,21.79 103.94,20.95 106.73,20.95 107.01,21.23 110.36,21.23 114.28,17.32 v114.28,15.09
  Bottom 0.406: v47.22,16.2 47.22,12.01 39.67,4.47 39.12,4.47 38.28,5.31 38.28,7.26 36.88,8.66 29.06,8.66 26.82,6.43 IC3.11 | v47.22,19.84 95.83,19.84 97.79,21.79 v97.79,23.75 | v114.28,15.09 114.28,14.53 116.23,12.57 116.23,8.66 115.67,8.1 115.67,7.26 114.83,6.43 113.72,6.43 112.88,7.26 112.88,8.1 112.04,8.94 107.85,8.94 106.73,7.82 SV_BUS_CONTROL_3.28
!CTRL_XFER_ASSERT_XFER
  Bottom 0.406: IC1.14 44.7,47.22 44.7,47.78 48.9,51.97 145.85,51.97 150.04,47.78 150.04,45.82 158.14,37.72 177.98,37.72 181.61,34.09 181.61,31.29 182.45,30.45 183.29,30.45 184.12,29.62 184.12,28.78 184.96,27.94 185.8,27.94 186.64,27.1 186.64,23.75 185.8,22.91 184.96,22.91 184.12,22.07 184.12,20.4 183.01,19.28 SV_BUS_CONTROL_2.12
!CTRL_XFER_L_ASSERT  (via drill 0.35)
  Top 0.406: v156.46,23.19 162.61,17.04 179.65,17.04 182.73,13.97 SV_BUS_CONTROL_2.8
  Bottom 0.406: v156.46,23.19 148.36,23.19 131.32,40.23 60.63,40.23 51.97,48.9 46.66,48.9 45.82,48.06 45.82,46.1 44.98,45.26 41.07,45.26 39.4,46.94 IC1.16
!CTRL_XFER_L_LOAD
  Bottom 0.406: IC2.16 164.01,47.22 166.8,50.01 178.26,50.01 182.45,45.82 184.12,45.82 185.24,44.7 SV_BUS_CONTROL_2.31
!CTRL_XFER_LOAD_XFER
  Bottom 0.406: IC2.14 169.04,47.22 170.71,48.9 174.07,48.9 182.45,40.51 184.12,40.51 185.24,39.4 SV_BUS_CONTROL_2.27
!CTRL_XFER_R_ASSERT  (via drill 0.35)
  Top 0.406: v61.75,41.63 57.28,37.16 56.44,37.16 55.88,37.72 55.88,38 51.97,41.91 46.94,41.91 41.91,46.94 IC1.15 | v143.05,34.37 145.01,32.41 145.01,30.45 v158.7,16.76
  Bottom 0.406: v61.75,41.63 135.79,41.63 v143.05,34.37 | v158.7,16.76 159.54,16.76 162.61,13.69 162.61,11.73 163.45,10.9 177.14,10.9 182.73,16.48 SV_BUS_CONTROL_2.10
!CTRL_XFER_R_LOAD
  Bottom 0.406: IC2.15 166.52,47.22 168.76,49.45 176.02,49.45 182.45,43.03 184.12,43.03 185.24,41.91 SV_BUS_CONTROL_2.29
BUS_CTRL1_REG_A_1
  Bottom 0.406: SV_BUS_CONTROL_1.34 6.43,48.34 8.1,48.34 8.66,48.9 19.28,48.9 20.95,47.22 21.51,47.22 IC1.23
BUS_CTRL2_REG_A_2
  Bottom 0.406: IC1.22 24.03,46.94 20.4,43.31 6.43,43.31 5.31,44.42 SV_BUS_CONTROL_1.32
BUS_CTRL3_REG_A_3
  Bottom 0.406: IC1.21 26.54,46.94 20.4,40.79 6.43,40.79 5.31,41.91 SV_BUS_CONTROL_1.30
BUS_CTRL4_REG_A_4
  Bottom 0.406: IC1.20 29.06,46.94 20.12,38 6.43,38 5.31,39.12 SV_BUS_CONTROL_1.28
BUS_CTRL5_REG_L_1  (via drill 0.35)
  Top 0.406: v59.79,43.59 58.95,42.75 47.22,42.75 v45.54,44.42
  Bottom 0.406: v59.79,43.59 142.49,43.59 145.85,46.94 IC2.23 | v45.54,44.42 27.38,44.42 18.44,35.48 6.43,35.48 SV_BUS_CONTROL_1.26
BUS_CTRL6_REG_L_2  (via drill 0.35)
  Top 0.406: v48.62,44.7 v57.28,44.7
  Bottom 0.406: IC2.22 146.69,48.9 119.3,48.9 115.11,44.7 v57.28,44.7 | v48.62,44.7 48.06,44.7 42.47,39.12 23.75,39.12 17.6,32.97 6.43,32.97 5.31,34.09 SV_BUS_CONTROL_1.24
BUS_CTRL7_REG_L_3  (via drill 0.35)
  Top 0.406: v14.81,52.53 8.1,45.82 7.26,45.82 6.43,44.98 6.43,32.97 5.31,31.85 SV_BUS_CONTROL_1.22
  Bottom 0.406: v14.81,52.53 146.13,52.53 150.88,47.78 150.88,47.22 IC2.21
BUS_CTRL8_REG_L_4
  Bottom 0.406: IC2.20 153.67,47.22 153.11,47.22 146.96,53.37 7.26,53.37 3.35,49.45 3.35,31.01 5.03,29.34 SV_BUS_CONTROL_1.20
BUS_CTRL9_16REG_A_ADDR_1
  Top 0.406: IC3.1 39.12,13.97 27.66,25.43 6.43,25.43 5.31,26.54 SV_BUS_CONTROL_1.18
BUS_CTRL10_16REG_A_ADDR_2
  Top 0.406: IC3.2 36.6,13.97 27.66,22.91 6.43,22.91 5.31,24.03 SV_BUS_CONTROL_1.16
BUS_CTRL11_16REG_A_ADDR_3
  Top 0.406: IC3.3 34.09,13.97 27.66,20.4 6.43,20.4 5.31,21.51 SV_BUS_CONTROL_1.14
BUS_CTRL12_CREG_INC_1  (via drill 0.35)
  Top 0.406: v46.38,23.47 48.06,25.15 64.82,25.15 67.06,22.91 IC4.1
  Bottom 0.406: v46.38,23.47 11.18,23.47 8.1,20.4 6.43,20.4 SV_BUS_CONTROL_1.12
BUS_CTRL13_CREG_INC_2
  Bottom 0.406: IC4.2 64.54,22.91 53.92,33.53 33.81,33.53 32.97,32.69 32.97,30.73 26.26,24.03 9.22,24.03 8.1,22.91 7.26,22.91 6.43,22.07 6.43,21.23 5.59,20.4 4.75,20.4 3.91,19.56 3.91,17.88 5.03,16.76 SV_BUS_CONTROL_1.10
BUS_CTRL14_CREG_DEC_1  (via drill 0.35)
  Top 0.406: v42.75,22.63 46.66,26.54 119.58,26.54 120.7,25.43 120.7,24.87 118.75,22.91 104.22,22.91 IC5.1
  Bottom 0.406: v42.75,22.63 15.37,22.63 7.82,15.09 6.43,15.09 5.31,13.97 SV_BUS_CONTROL_1.8
BUS_CTRL15_CREG_DEC_2
  Bottom 0.406: IC5.2 101.42,22.63 97.79,19 46.66,19 39.95,12.29 8.38,12.29 8.1,12.57 6.43,12.57 5.31,11.46 SV_BUS_CONTROL_1.6
BUS_CTRL17_GPR_A_ALU_R_1
  Top 0.406: IC6.1 140.82,22.91 129.92,33.81 128.25,33.81 124.89,37.16 58.12,37.16 56.16,35.2 52.81,35.2 47.5,29.9 46.66,29.9 45.54,31.01 45.54,32.97 39.4,39.12 10.62,39.12 7.82,41.91 SV_BUS_CONTROL_1.29
BUS_CTRL18_GPR_A_ALU_R_2  (via drill 0.35)
  Top 0.406: v69.29,36.32 124.89,36.32 138.3,22.91 IC6.2 | v66.22,39.4 57.56,48.06 48.06,48.06 46.66,49.45 12.57,49.45 7.82,44.7 SV_BUS_CONTROL_1.31
  Bottom 0.406: v66.22,39.4 v69.29,36.32
BUS_CTRL19_GPR_A_ALU_R_3  (via drill 0.35)
  Top 0.406: v43.31,36.32 39.95,39.67 17.88,39.67 v10.9,46.66
  Bottom 0.406: v43.31,36.32 52.25,36.32 61.47,27.1 106.17,27.1 108.97,24.31 120.14,24.31 120.42,24.59 134.11,24.59 135.79,22.91 IC6.3 | v10.9,46.66 8.1,46.66 7.82,46.94 SV_BUS_CONTROL_1.33
BUS_CTRL20_GPR_A_ALU_L_1  (via drill 0.35)
  Top 0.406: v48.06,45.54 58.95,45.54 65.94,38.56 124.33,38.56 128.52,34.37 132.44,34.37 151.99,14.81 161.49,14.81 162.33,13.97 162.33,12.01 163.45,10.9 167.08,10.9 168.76,12.57 IC7.1
  Bottom 0.406: v48.06,45.54 42.19,39.67 23.47,39.67 18.16,34.37 7.82,34.37 SV_BUS_CONTROL_1.23
BUS_CTRL21_GPR_A_ALU_L_2  (via drill 0.35)
  Top 0.406: v131.88,26.82 124.33,34.37 v53.09,34.37 | v32.69,34.37 10.06,34.37 7.82,36.6 SV_BUS_CONTROL_1.25
  Bottom 0.406: v131.88,26.82 139.98,26.82 145.57,21.23 157.86,21.23 166.24,12.85 IC7.2 | v32.69,34.37 v53.09,34.37
BUS_CTRL22_GPR_A_ALU_L_3  (via drill 0.35)
  Top 0.406: v137.19,30.73 152.55,15.37 161.77,15.37 163.73,13.41 163.73,12.85 IC7.3 | v129.08,30.73 124.61,35.2 v57.28,35.2 | v33.25,37.16 9.78,37.16 7.82,39.12 SV_BUS_CONTROL_1.27
  Bottom 0.406: v129.08,30.73 v137.19,30.73 | v57.28,35.2 54.2,35.2 52.25,37.16 v33.25,37.16
GND  (via drill 0.35)
  Top 0.406: IC2.18 158.7,46.94 156.46,46.94 IC2.19 156.19,46.94 156.19,38.42 | SV_BUS_CONTROL_4.35 117.07,48.06 129.92,48.06 139.7,38.28 C7.2 | 168.66,34.54 182.45,48.34 183.29,48.34 184.4,49.45 185.24,49.45 SV_BUS_CONTROL_2.35 | IC6.4 133.27,22.91 131.04,22.91 IC6.5 130.76,22.63 130.76,20 | IC7.4 161.21,12.85 158.98,12.85 IC7.5 158.7,12.57 158.7,9.84 | 177.85,4.88 172.95,9.78 C6.2 | C5.2 145.01,19.84 150.88,13.97 150.88,12.85 IC7.8 | IC5.5 94.16,22.91 96.39,22.91 IC5.4 96.67,22.91 98.91,22.91 IC5.3 99.19,22.63 99.19,20 | v113.44,17.04 110.92,17.04 108.13,19.84 C4.2 | IC3.4 29.34,13.97 | SV_BUS_CONTROL_1.2 5.31,6.15 6.15,6.15 7.26,5.03 12.85,5.03 21.51,13.69 IC3.8 | 29.34,11.11 29.34,13.97 | 29.34,13.97 IC3.5 | IC4.5 57.28,22.91 59.51,22.91 IC4.4 59.79,22.91 62.03,22.91 IC4.3 62.31,22.63 62.31,20 | SV_BUS_CONTROL_3.2 73.48,7.82 73.48,17.88 71.25,20.12 C3.2 | IC1.19 31.85,46.94 34.09,46.94 IC1.18 34.37,46.94 39.95,41.35 51.69,41.35 51.97,41.07 51.97,39.4 50.85,38.28 C1.2
  Top 0.508: C11.2 70.17,50.8 SV_BUS_CONTROL_4.2 | C1.2 46.99,34.61 IC1.12 | C10.2 11.54,51.23 11.54,51.15 9.91,49.53 SV_BUS_CONTROL_1.35 | C2.2 29.34,11.11 24.45,11.11 IC3.8 | C3.2 62.31,20 52.39,20 IC4.8 | C9.2 117.16,5.4 SV_BUS_CONTROL_3.35 | C4.2 99.19,20 89.22,20 IC5.8 | C5.2 130.76,20 126.05,20 IC6.8 | C6.2 158.7,9.84 153.99,9.84 IC7.8 | C8.2 177.69,4.65 177.69,4.73 177.85,4.88 177.93,4.97 181.5,4.97 SV_BUS_CONTROL_2.2 | C7.2 156.19,38.42 164.78,38.42 168.66,34.54 IC2.12
  Bottom 0.406: SV_BUS_CONTROL_4.2 73.76,50.57 74.6,50.57 75.72,49.45 115.67,49.45 116.79,48.34 SV_BUS_CONTROL_4.35 | v113.44,17.04 118.19,12.29 118.19,7.26 117.07,6.15 117.07,5.31 SV_BUS_CONTROL_3.35 | SV_BUS_CONTROL_1.35 7.82,49.45 29.34,49.45 31.57,47.22 IC1.19 | IC1.12 47.22,31.57 49.45,29.34 49.45,22.91 IC4.8 49.45,22.63 48.62,21.79 39.67,21.79 31.85,13.97 IC3.4 | IC4.3 62.31,22.63 63.98,20.95 67.61,20.95 69.29,22.63 86.33,22.63 IC5.8 86.61,22.91 88.85,25.15 105.05,25.15 108.97,21.23 110.64,21.23 112.04,22.63 122.94,22.63 IC6.8 | SV_BUS_CONTROL_2.35 185.52,49.45 185.52,48.62 188.87,45.26 188.87,10.62 185.8,7.54 184.12,7.54 183.01,6.43 SV_BUS_CONTROL_2.2
  pour Top: -2.54,50.8 5.08,58.42 187.96,58.42 195.58,50.8 195.58,49.53 195.58,7.62 185.42,-2.54 3.81,-2.54 -2.54,3.81
N$11
  Bottom 0.406: IC1.13 47.22,46.94 53.09,46.94 60.63,39.4 65.1,39.4 69.01,35.48 130.48,35.48 131.04,36.04 134.67,36.04 148.36,22.35 182.17,22.35 182.73,21.79 SV_BUS_CONTROL_2.14
VCC  (via drill 0.35)
  Top 0.406: C7.1 139.7,40.51 129.64,50.57 117.07,50.57 SV_BUS_CONTROL_4.36 116.79,50.57 115.67,49.45 75.72,49.45 74.6,48.34 73.76,48.34 SV_BUS_CONTROL_4.1 | SV_BUS_CONTROL_2.36 182.73,49.45 145.85,49.45 143.61,47.22 IC2.24 | 171.18,7.35 176.02,2.52 177.7,2.52 177.98,2.79 177.98,3.07 178.54,3.63 C8.1 | v143.33,18.44 143.75,18.02 | IC4.6 54.48,22.91 52.81,24.59 48.9,24.59 48.34,24.03 48.34,21.79 53.09,17.04 65.38,17.04 67.06,15.37 IC4.16 67.33,15.09 67.33,12.01 73.76,5.59 SV_BUS_CONTROL_3.1 73.76,5.31 74.88,6.43 74.88,8.1 82.42,15.65 82.42,19.28 | 82.42,19.28 82.42,21.23 85.78,24.59 89.69,24.59 91.36,22.91 IC5.6 | 105.22,16.32 102.26,19.28 82.42,19.28 | 13.83,12.43 7.82,6.43 SV_BUS_CONTROL_1.1 | 13.83,12.43 17.04,15.65 24.87,15.65 26.54,13.97 IC3.6 | 13.83,12.43 8.38,17.88 4.47,17.88 3.91,18.44 3.91,47.5 5.03,48.62 5.03,49.45 SV_BUS_CONTROL_1.36 | C11.1 69.85,48.62 48.34,48.62 43.59,53.37 11.73,53.37 10.62,52.25 C10.1
  Top 0.508: C11.1 73.34,48.58 SV_BUS_CONTROL_4.1 | C1.1 25.72,40.32 IC1.24 | C10.1 9.11,50.7 7.14,50.7 5.97,49.53 SV_BUS_CONTROL_1.36 | C2.1 42.23,9.21 IC3.16 | C3.1 70.17,18.1 IC4.16 | C9.1 117.16,7.3 SV_BUS_CONTROL_3.36 | C4.1 107,18.1 105.22,16.32 IC5.16 | C5.1 143.83,18.1 143.75,18.02 IC6.16 | C6.1 171.77,7.94 171.18,7.35 IC7.16 | C8.1 182.88,3.81 SV_BUS_CONTROL_2.1 | C7.1 143.51,44.13 IC2.24
  Bottom 0.406: IC6.16 129.64,3.91 116.23,3.91 115.67,4.47 115.67,5.59 116.79,6.71 116.79,7.54 SV_BUS_CONTROL_3.36 | IC7.16 168.76,5.31 167.08,6.99 163.17,6.99 160.38,9.78 158.7,9.78 156.46,12.01 156.46,12.57 IC7.6 156.19,12.85 148.92,20.12 143.33,20.12 | 143.33,20.12 131.04,20.12 128.52,22.63 IC6.6 128.25,22.63 127.69,22.63 125.73,20.68 108.69,20.68 104.78,24.59 93.32,24.59 91.64,22.91 IC5.6 | 143.33,20.12 v143.33,18.44 | IC1.24 17.88,45.82 4.47,45.82 3.91,46.38 3.91,47.5 5.03,48.62 5.03,49.45 SV_BUS_CONTROL_1.36 | 38.14,8.24 37.16,9.22 10.62,9.22 7.82,6.43 SV_BUS_CONTROL_1.1 | 38.14,8.24 39.12,7.26 39.12,6.43 IC3.16 | 38.14,8.24 47.78,17.88 59.23,17.88 60.91,16.2 60.91,14.25 61.75,13.41 65.38,13.41 67.06,15.09 IC4.16
  pour Bottom: -2.54,50.8 5.08,58.42 187.96,58.42 195.58,50.8 195.58,7.62 185.42,-2.54 3.81,-2.54 -2.54,3.81

### Text on the board
tPlace: Bus Control | V 1.1 | by Dargonrol